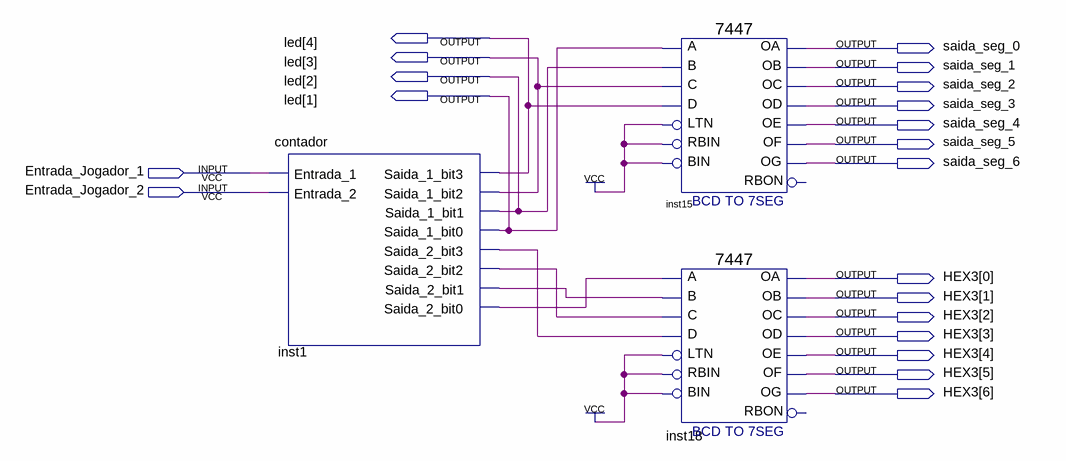
[diagram p0: schematic sheet]
// Quartus schematic seven_segment.bdf as structural Verilog: 3 symbols, 20 pins
module seven_segment (
  input  Entrada_Jogador_1,
  input  Entrada_Jogador_2,
  output [4:1] led,
  output saida_seg_0,
  output saida_seg_1,
  output saida_seg_2,
  output saida_seg_3,
  output saida_seg_4,
  output saida_seg_5,
  output saida_seg_6,
  output [6:0] HEX3
);

  wire inst1_saida_2_bit0, inst1_saida_2_bit1, inst1_saida_2_bit2, inst1_saida_2_bit3;

  contador inst1 (
    .Entrada_1(Entrada_Jogador_1), .Entrada_2(Entrada_Jogador_2), .Saida_1_bit3(led[4]),
    .Saida_1_bit2(led[3]), .Saida_1_bit1(led[2]), .Saida_1_bit0(led[1]), .Saida_2_bit3(inst1_saida_2_bit3),
    .Saida_2_bit2(inst1_saida_2_bit2), .Saida_2_bit1(inst1_saida_2_bit1), .Saida_2_bit0(inst1_saida_2_bit0));
  \7447  inst15 (
    .LTN(1'b1), .B(led[2]), .C(led[3]), .D(led[4]), .RBIN(1'b1), .BIN(1'b1), .A(led[1]), .OB(saida_seg_1),
    .OC(saida_seg_2), .OE(saida_seg_4), .OD(saida_seg_3), .OF(saida_seg_5), .OG(saida_seg_6), .OA(saida_seg_0));  // open: RBON
  \7447  inst18 (
    .LTN(1'b1), .B(inst1_saida_2_bit1), .C(inst1_saida_2_bit2), .D(inst1_saida_2_bit3), .RBIN(1'b1),
    .BIN(1'b1), .A(inst1_saida_2_bit0), .OB(HEX3[1]), .OC(HEX3[2]), .OE(HEX3[4]), .OD(HEX3[3]), .OF(HEX3[5]),
    .OG(HEX3[6]), .OA(HEX3[0]));  // open: RBON
endmodule
